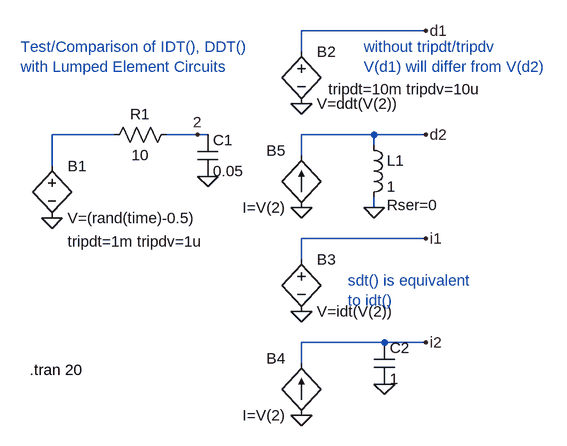
[diagram p0: schematic idt_ddt_test.asc]
idt_ddt_test.asc, the LTspice schematic file:
Version 4
SHEET 1 880 680
WIRE -80 192 -80 144
WIRE 16 144 -80 144
WIRE 144 144 96 144
WIRE 160 144 144 144
WIRE 304 16 304 -16
WIRE 304 176 304 144
WIRE 304 336 304 304
WIRE 304 496 304 464
WIRE 416 144 304 144
WIRE 416 160 416 144
WIRE 416 256 416 240
WIRE 432 464 304 464
WIRE 496 -16 304 -16
WIRE 496 144 416 144
WIRE 496 304 304 304
WIRE 496 464 432 464
FLAG -80 272 0
FLAG 160 208 0
FLAG 496 -16 d1
FLAG 144 144 2
FLAG 304 96 0
FLAG 496 304 i1
FLAG 304 416 0
FLAG 496 464 i2
FLAG 304 576 0
FLAG 432 528 0
FLAG 304 256 0
FLAG 496 144 d2
FLAG 416 256 0
SYMBOL bv -80 176 R0
WINDOW 123 24 132 Left 0
SYMATTR Value2 tripdt=1m tripdv=1u
SYMATTR InstName B1
SYMATTR Value V=(rand(time)-0.5)
SYMBOL res 0 160 R270
WINDOW 0 32 56 VTop 0
WINDOW 3 0 56 VBottom 0
SYMATTR InstName R1
SYMATTR Value 10
SYMBOL cap 144 144 R0
SYMATTR InstName C1
SYMATTR Value 0.05
SYMBOL bv 304 0 R0
WINDOW 123 42 74 Left 0
SYMATTR Value2 tripdt=10m tripdv=10u
SYMATTR InstName B2
SYMATTR Value V=ddt(V(2))
SYMBOL bv 304 320 R0
SYMATTR InstName B3
SYMATTR Value V=idt(V(2))
SYMBOL cap 416 464 R0
SYMATTR InstName C2
SYMATTR Value 1
SYMBOL bi 304 576 R180
WINDOW 0 24 88 Left 0
WINDOW 3 24 0 Left 0
SYMATTR InstName B4
SYMATTR Value I=V(2)
SYMBOL bi 304 256 R180
WINDOW 0 24 88 Left 0
WINDOW 3 24 0 Left 0
SYMATTR InstName B5
SYMATTR Value I=V(2)
SYMBOL ind 400 144 R0
WINDOW 39 36 108 Left 0
SYMATTR SpiceLine Rser=0
SYMATTR InstName L1
SYMATTR Value 1
TEXT -114 506 Left 0 !.tran 20
TEXT -128 8 Left 0 ;Test/Comparison of IDT(), DDT()\nwith Lumped Element Circuits
TEXT 400 8 Left 0 ;without tripdt/tripdv\nV(d1) will differ from V(d2)
TEXT 376 368 Left 0 ;sdt() is equivalent\nto idt()

The netlist it stands for:
* idt_ddt_test.asc
B1 N001 0 V=(rand(time)-0.5) tripdt=1m tripdv=1u
R1 N001 2 10
C1 2 0 0.05
B2 d1 0 V=ddt(V(2)) tripdt=10m tripdv=10u
B3 i1 0 V=idt(V(2))
C2 i2 0 1
B4 0 i2 I=V(2)
B5 0 d2 I=V(2)
L1 d2 0 1 Rser=0
.tran 20
* Test/Comparison of IDT(), DDT()
* with Lumped Element Circuits
* without tripdt/tripdv
* V(d1) will differ from V(d2)
* sdt() is equivalent
* to idt()
.backanno
.end